# EAGLE design main_16_writer (EAGLE 7.4.0)
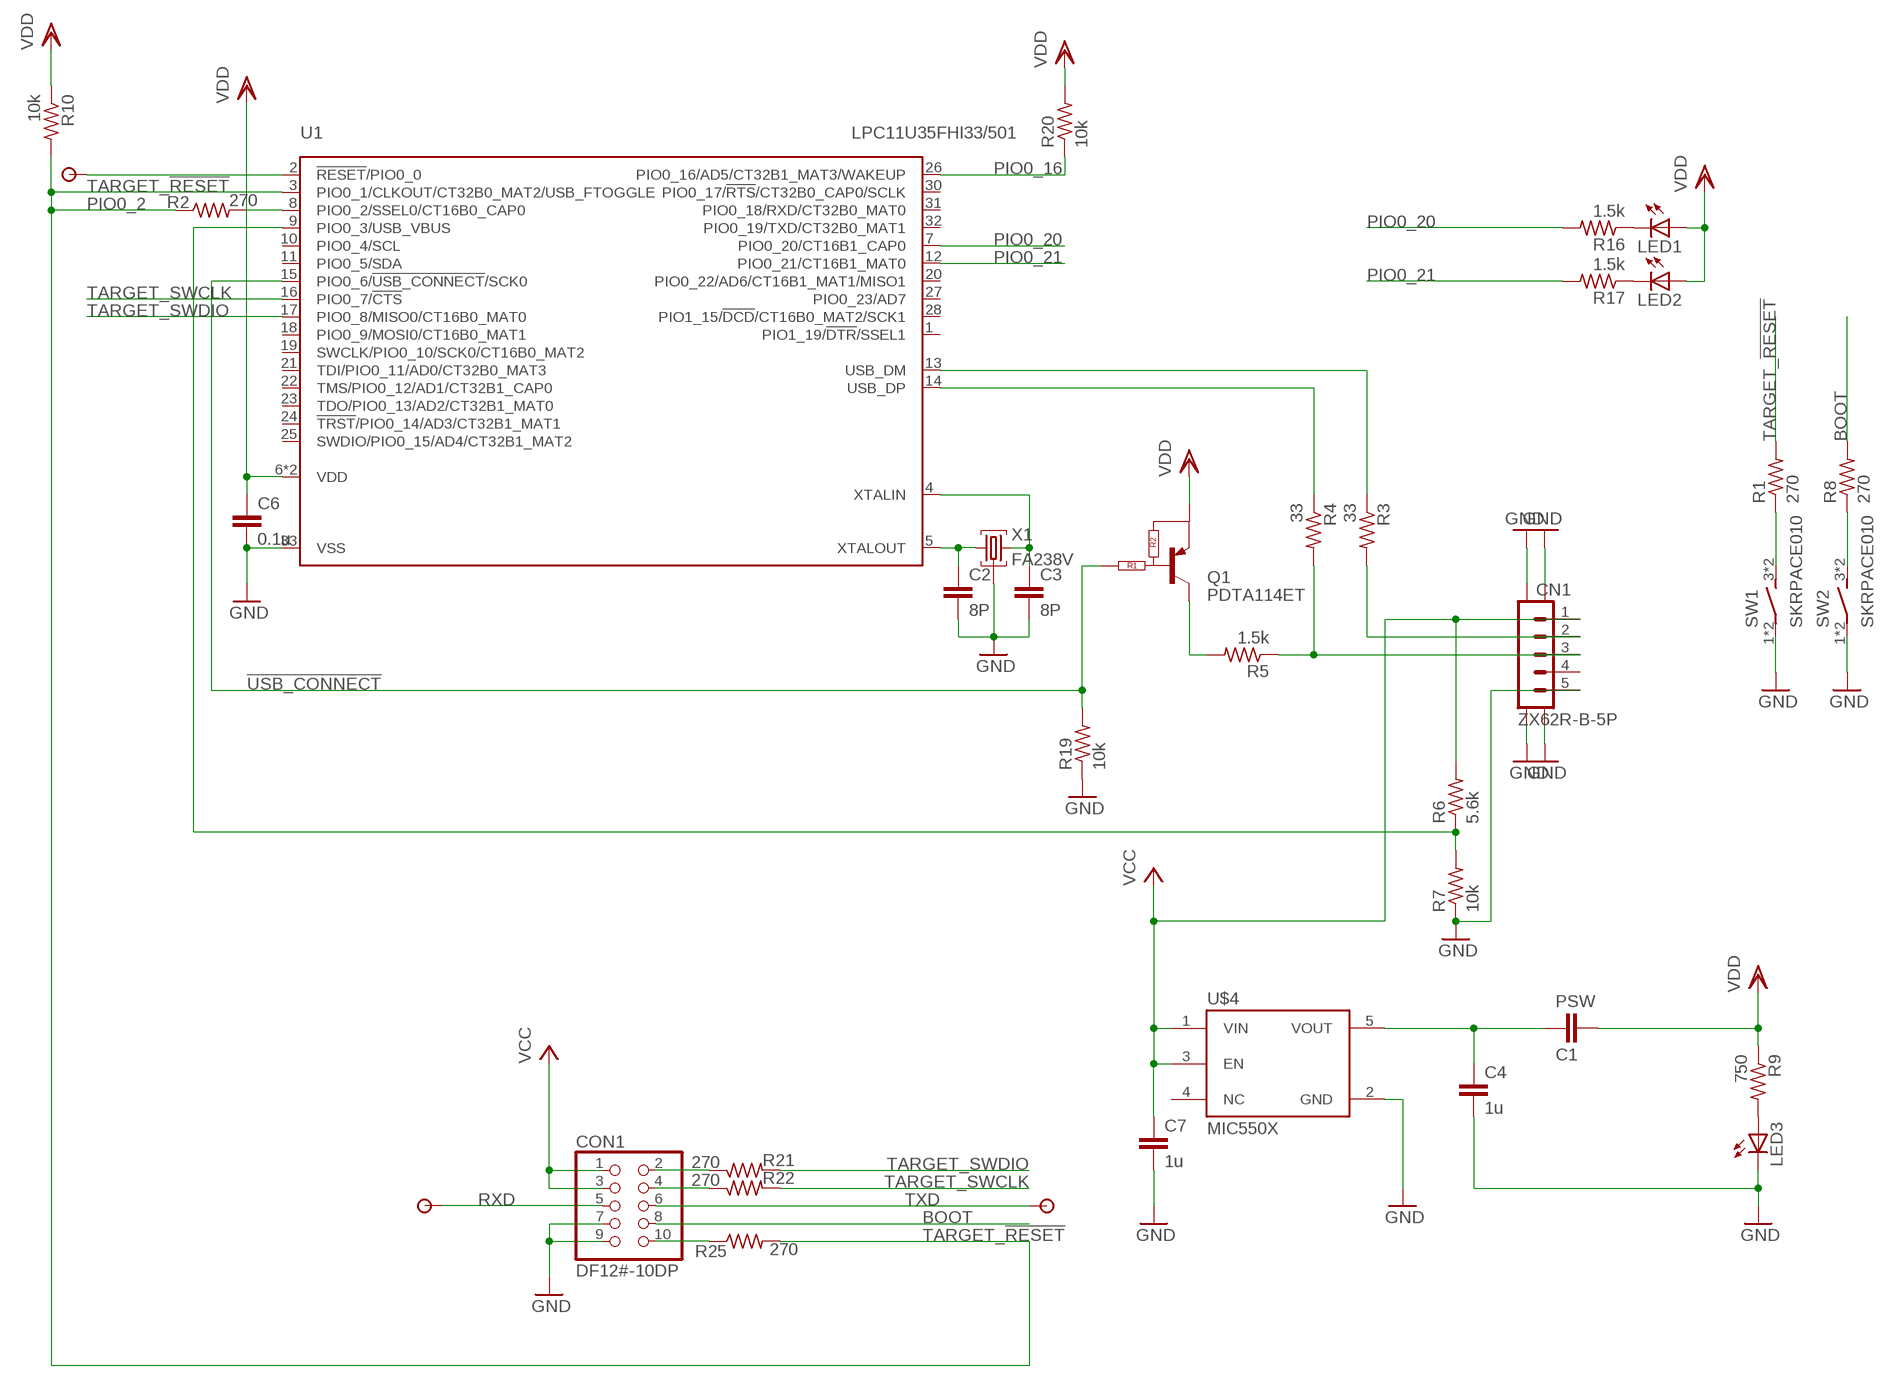
[diagram p0: schematic, sheet 1]

## Parts
C1  PSW  C-EUC3225  [C3225]
C2  8P  C-EUC0402  [C0402]
C3  8P  C-EUC0402  [C0402]
C4  1u  C-EUC0402  [C0402]
C6  0.1u  C-EUC0402  [C0402]
C7  1u  C-EUC0402  [C0402]
CN1  ZX62R-B-5P  [MICRO-B]
CON1  DF12#-10DP  [DF12D-10DP]
LED1  LEDSML0603  [SML0603]
LED2  LEDSML0603  [SML0603]
LED3  LEDSML0603  [SML0603]
Q1  PDTA114ET  [SOT23]
R1  270  R-US_R0402  [R0402]
R2  270  R-US_R0402  [R0402]
R3  33  R-US_R0402  [R0402]
R4  33  R-US_R0402  [R0402]
R5  1.5k  R-US_R0402  [R0402]
R6  5.6k  R-US_R0402  [R0402]
R7  10k  R-US_R0402  [R0402]
R8  270  R-US_R0402  [R0402]
R9  750  R-US_R0402  [R0402]
R10  10k  R-US_R0402  [R0402]
R16  1.5k  R-US_R0402  [R0402]
R17  1.5k  R-US_R0402  [R0402]
R19  10k  R-US_R0402  [R0402]
R20  10k  R-US_R0402  [R0402]
R21  270  R-US_R0402  [R0402]
R22  270  R-US_R0402  [R0402]
R25  270  R-US_R0402  [R0402]
SW1  SKRPACE010  [SKRPACE010]
SW2  SKRPACE010  [SKRPACE010]
U1  LPC11U35FHI33/501  [SOT617-3]
U$1  TESTPAD  [TESTPAD]
U$2  TESTPAD  [TESTPAD]
U$3  TESTPAD  [TESTPAD]
U$4  MIC550X  [SOT23_5PIN]
X1  FA238V  [V66RA]

## Nets
!USB_CONNECT!: Q1.1(INPUT) R19.2 U1.15(PIO0_6/!USB_CONNECT!/SCK0)
BOOT: CON1.8 R8.2
D+USB: CN1.3(3.D+) R4.2 R5.1
D-USB: CN1.2(4.ID) R3.2
GND: C2.2 C3.2 C4.2 C6.2 C7.2 CN1.5(1.VBUS) CN1.CASE@1 CN1.CASE@2 CN1.CASE@3 CN1.CASE@4 CON1.7 CON1.9 LED3.C R7.1 R19.1 SW1.1(P) SW1.2(P) SW2.1(P) SW2.2(P) U1.33(VSS) U$4.2(GND) X1.P2GND(GND) X1.P4GND(GND)
N$1: LED1.C R16.1
N$2: C2.1 U1.5(XTALOUT) X1.P1X1(X1)
N$3: C3.1 U1.4(XTALIN) X1.P3X2(X2)
N$4: C1.2 C4.1 U$4.5(VOUT)
N$5: R1.1 SW1.3(S) SW1.4(S)
N$6: Q1.3(C) R5.2
N$7: R4.1 U1.14(USB_DP)
N$8: R3.1 U1.13(USB_DM)
N$9: CON1.10 R25.1
N$10: LED2.C R17.1
N$11: R8.1 SW2.3(S) SW2.4(S)
N$12: U1.2(!RESET!/PIO0_0) U$3.P$1
N$14: CON1.2 R21.1
N$15: CON1.4 R22.1
N$20: LED3.A R9.2
PIO0_2: R2.2 U1.8(PIO0_2/SSEL0/CT16B0_CAP0)
PIO0_16: R20.1 U1.26(PIO0_16/AD5/CT32B1_MAT3/WAKEUP)
PIO0_20: R16.2 U1.7(PIO0_20/CT16B1_CAP0)
PIO0_21: R17.2 U1.12(PIO0_21/CT16B1_MAT0)
RXD: CON1.5 U$2.P$1
TARGET_!RESET!: R1.2 R2.1 R10.2 R25.2 U1.3(PIO0_1/CLKOUT/CT32B0_MAT2/USB_FTOGGLE)
TARGET_SWCLK: R22.2 U1.16(PIO0_7/!CTS!)
TARGET_SWDIO: R21.2 U1.17(PIO0_8/MISO0/CT16B0_MAT0)
TXD: CON1.6 U$1.P$1
USB_VBUS: R6.1 R7.2 U1.9(PIO0_3/USB_VBUS)
VCC: C7.1 CN1.1(5.GND) CON1.1 CON1.3 R6.2 U$4.1(VIN) U$4.3(EN)
VDD: C1.1 C6.1 LED1.A LED2.A Q1.2(E) R9.1 R10.1 R20.2 U1.6(VDD) U1.29(VDD)
Unconnected: CN1.4(2.D-) U1.1(PIO1_19/!DTR!/SSEL1) U1.10(PIO0_4/SCL) U1.11(PIO0_5/SDA) U1.18(PIO0_9/MOSI0/CT16B0_MAT1) U1.19(SWCLK/PIO0_10/SCK0/CT16B0_MAT2) U1.20(PIO0_22/AD6/CT16B1_MAT1/MISO1) U1.21(TDI/PIO0_11/AD0/CT32B0_MAT3) U1.22(TMS/PIO0_12/AD1/CT32B1_CAP0) U1.23(TDO/PIO0_13/AD2/CT32B1_MAT0) U1.24(!TRST!/PIO0_14/AD3/CT32B1_MAT1) U1.25(SWDIO/PIO0_15/AD4/CT32B1_MAT2) U1.27(PIO0_23/AD7) U1.28(PIO1_15/!DCD!/CT16B0_MAT2/SCK1) U1.30(PIO0_17/!RTS!/CT32B0_CAP0/SCLK) U1.31(PIO0_18/RXD/CT32B0_MAT0) U1.32(PIO0_19/TXD/CT32B0_MAT1) U$4.4(NC)

## Library data of the parts
C1-C4 C6 C7 = rcl:C-EU: CAPACITOR, European symbol
CN1 = con-USB:ZX62R-B-5P
CON1 = untitled:DF12#-10
LED1-LED3 = led:LED: LED OSRAM: - CHIPLED LG R971, LG N971, LY N971, LG Q971, LY Q971, LO R971, LY R971 LH N974, LH R974 LS Q976, LO Q976, LY Q976 LO Q996 - Hyper CHIPLED LW Q18S LB Q993, LB Q99A, LB R99A - SideLED LS A670, LO A670, LY A670, LG A670, LP A670 LB A673, LV A673, LT A673, LW A673 LH A674 LY A675 LS A676, LA A676, LO A676, LY A676, LW A676 LS A679, LY A679, LG A679 - Hyper Micro SIDELED® LS Y876, LA Y876, LO Y876, LY Y876 LT Y87S - SmartLED LW L88C, LW L88S LB L89C, LB L89S, LG L890 LS L89K, LO L89K, LY L89K LS L896, LA L896, LO L896, LY L896 - TOPLED LS T670, LO T670, LY T670, LG T670, LP T670 LSG T670, LSP T670, LSY T670, LOP T670, LYG T670 LG T671, LOG T671, LSG T671 LB T673, LV T673, LT T673, LW T673 LH T674 LS T676, LA T676, LO T676, LY T676, LB T676, LH T676, LSB T676, LW T676 LB T67C, LV T67C, LT T67C, LS T67K, LO T67K, LY T67K, LW E67C LS E67B, LA E67B, LO E67B, LY E67B, LB E67C, LV E67C, LT E67C LW T67C LS T679, LY T679, LG T679 LS T770, LO T770, LY T770, LG T770, LP T770 LB T773, LV T773, LT T773, LW T773 LH T774 LS E675, LA E675, LY E675, LS T675 LS T776, LA T776, LO T776, LY T776, LB T776 LHGB T686 LT T68C, LB T68C - Hyper Mini TOPLED® LB M676 - Mini TOPLED Santana® LG M470 LS M47K, LO M47K, LY M47K Source: http://www.osram.convergy.de LUXEON: - LUMILED® LXK2-PW12-R00, LXK2-PW12-S00, LXK2-PW14-U00, LXK2-PW14-V00 LXK2-PM12-R00, LXK2-PM12-S00, LXK2-PM14-U00 LXK2-PE12-Q00, LXK2-PE12-R00, LXK2-PE12-S00, LXK2-PE14-T00, LXK2-PE14-U00 LXK2-PB12-K00, LXK2-PB12-L00, LXK2-PB12-M00, LXK2-PB14-N00, LXK2-PB14-P00, LXK2-PB14-Q00 LXK2-PR12-L00, LXK2-PR12-M00, LXK2-PR14-Q00, LXK2-PR14-R00 LXK2-PD12-Q00, LXK2-PD12-R00, LXK2-PD12-S00 LXK2-PH12-R00, LXK2-PH12-S00 LXK2-PL12-P00, LXK2-PL12-Q00, LXK2-PL12-R00 Source: www.luxeon.com KINGBRIGHT: KA-3528ASYC Source: www.kingbright.com
Q1 = nxp_60_1_1:PDTA114: PNP Resistor-Equipped Transistor (RET) family in small Surface-Mounted Device (SMD) plastic packages. AAL Eindhoven MK
R1-R10 R16 R17 R19-R22 R25 = rcl:R-US_: RESISTOR, American symbol
SW1 SW2 = untitled:SKRPACE010
U1 = nxp_60_1_1:LPC11U35FHI33: 32-bit ARM Cortex-M0 microcontroller; up to 128 kB flash; up to 12 kB SRAM and 4 kB EEPROM; USB device; USART The LPC11U3x are a ARM Cortex-M0 based, low-cost 32-bit MCU family, designed for 8/16-bit microcontroller applications, offering performance, low power, simple instruction set and memory addressing together with reduced code size compared to existing 8/16-bit architectures. The LPC11U3x operate at CPU frequencies of up to 50 MHz. Equipped with a highly flexible and configurable Full Speed USB 2.0 device controller, the LPC11U3x brings unparalleled design flexibility and seamless integration to today’s demanding connectivity solutions. The peripheral complement of the LPC11U3x includes up to 128 kB of flash memory, up to 12 kB of SRAM data memory and 4 kB EEPROM, one Fast-mode Plus I 2 C-bus interface, one RS-485/EIA-485 USART with support for synchronous mode and smart card interface, two SSP interfaces, four general purpose counter/timers, a 10-bit ADC, and up to 54 general purpose I/O pins. AAL Eindhoven MK; FLASH: 64kB; GPIO: 26; SRAM: 12kB
U$1-U$3 = untitled:TESTPAD
U$4 = untitled:MIC550X
X1 = 201508-noshiro:FA238V: EPSON TOYOCOM CRYSTAL V66RA package FA238V

## Board
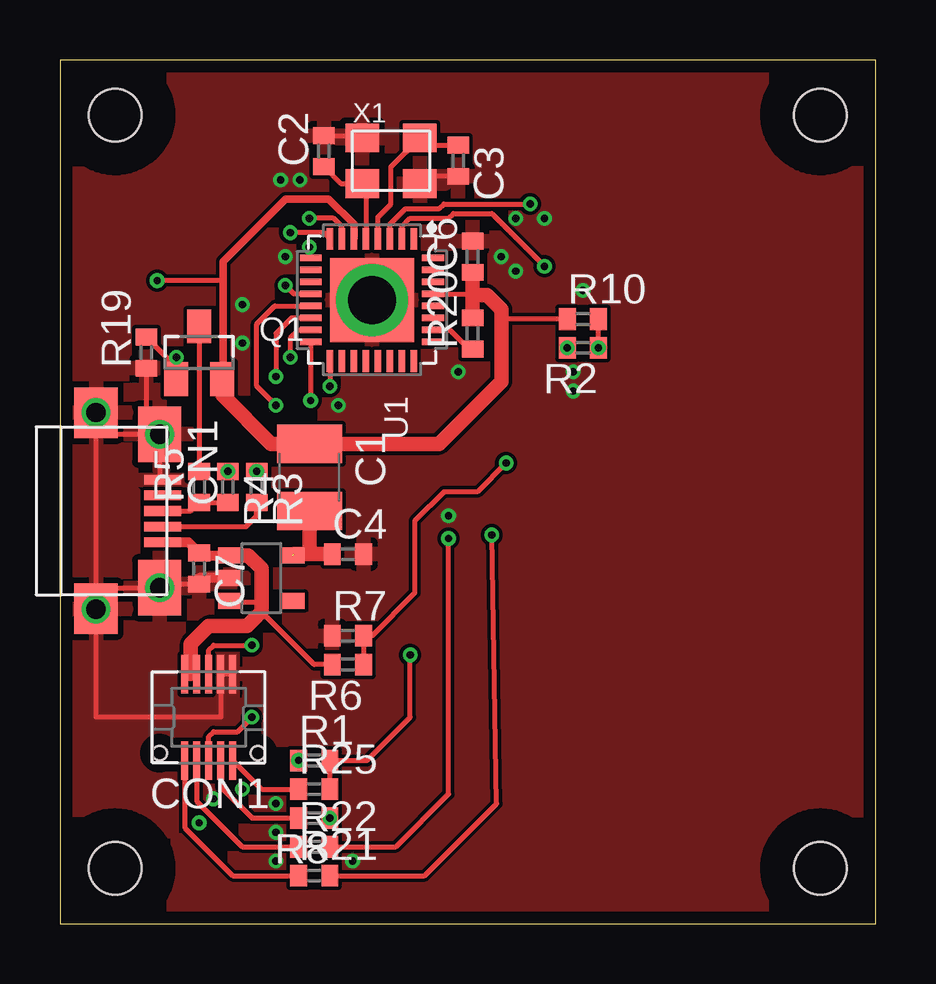
[diagram p1: board, top side]
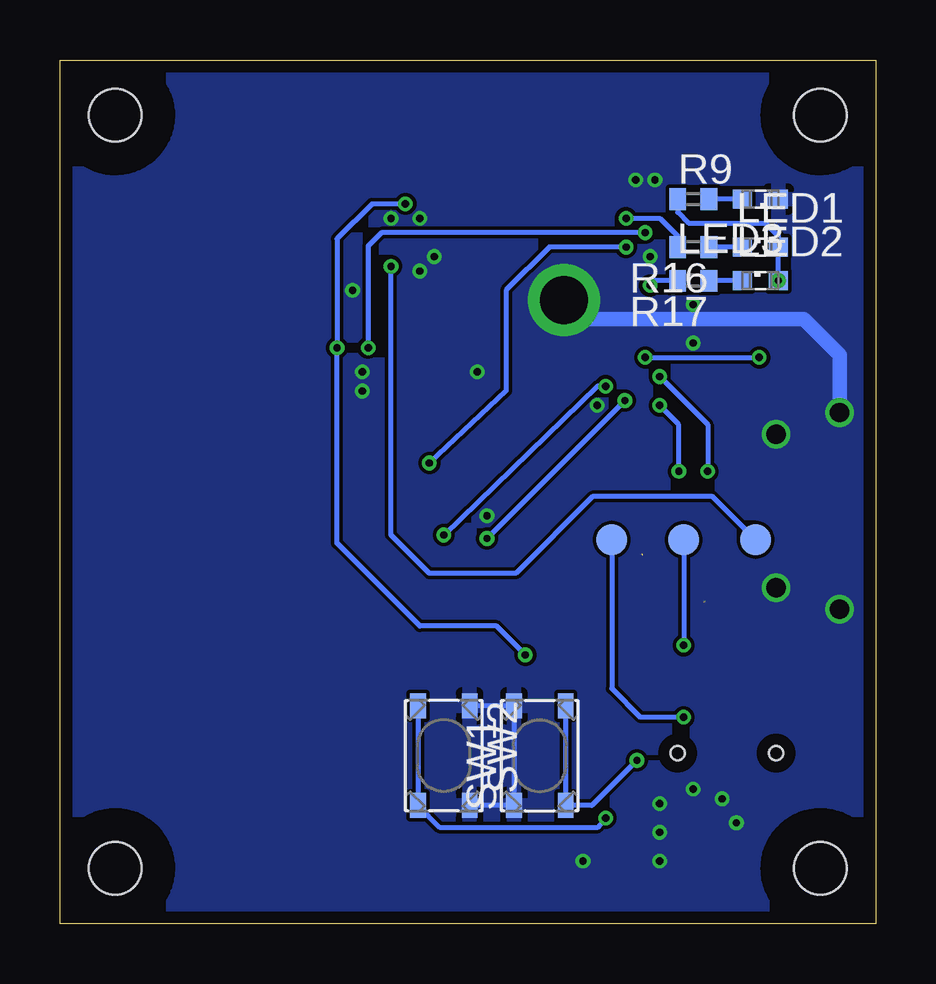
[diagram p2: board, bottom side, seen from below]

Size 34 x 36 mm. Coordinates in mm from the lower left corner, seen from the top.
Outline: 0,0 34,0 34,36 0,36 0,0
Copper layers (1*16): Top 0.035mm / dielectric 1.6mm / Bottom 0.035mm
Design rules "Elecrow_2-layer_PCB_eagle_rule": minimum track width 6mil, minimum drill 12mil, track to track 6mil, track to pad 6mil, pad to pad 6mil, via to via 8mil, smd to smd 0mil, copper to edge 20mil, drill to drill 10mil, minimum pad ring 6mil, minimum via ring 6mil, stop-mask expansion 0mil, vias tented up to drill 100mil, thermal gap 10mil
Holes 2.2 mm at 2.3,2.3 31.7,2.3 31.7,33.7 2.3,33.7
tRestrict: area 0,0 to 4.6,4.6; area 29.4,0 to 34,4.6; area 29.4,31.4 to 34,36; area 0,31.4 to 4.6,36
bRestrict: area 0,0 to 4.6,4.6; area 29.4,0 to 34,4.6; area 29.4,31.4 to 34,36; area 0,31.4 to 4.6,36

### Footprints (pad centres in the part's own frame; a part is rotated, then mirrored left to right if it is on the bottom)
C3225 = smd 1.6 x 2.7: 1 -1.4,0; 2 1.4,0
C0402 = smd 0.7 x 0.9: 1 -0.65,0; 2 0.65,0
MICRO-B = smd 0.4 x 1.55: 1 1.3,2.775; 2 0.65,2.775; 3 0,2.775; 4 -0.65,2.775; 5 -1.3,2.775 | smd 2.3 x 1.8: CASE@1 -3.2,2.65; CASE@2 3.2,2.65 | smd 2.1 x 1.8: CASE@3 -4.1,0; CASE@4 4.075,0
DF12D-10DP = smd 0.3 x 1.6 bottom: 1 -1,-1.8; 2 -1,1.8; 3 -0.5,-1.8; 4 -0.5,1.8; 5 0,-1.8; 6 0,1.8; 7 0.5,-1.8; 8 0.5,1.8; 9 1,-1.8; 10 1,1.8 | hole 0.6: 2.05,1.5; -2.05,1.5
SML0603 = smd 0.8 x 0.8: A 0.75,0; C -0.75,0
SOT23 = smd 1 x 1.4: 1 -0.95,-1.1; 2 0.95,-1.1; 3 0,1.1
R0402 = smd 0.7 x 0.9: 1 -0.65,0; 2 0.65,0
SKRPACE010 = smd 1.05 x 0.65: 1 -2.075,1.075; 2 2.075,1.075; 3 -2.075,-1.075; 4 2.075,-1.075
SOT617-3 = smd 0.9 x 0.29: 1 -2.55,1.75; 2 -2.55,1.25; 3 -2.55,0.75; 4 -2.55,0.25; 5 -2.55,-0.25; 6 -2.55,-0.75; 7 -2.55,-1.25; 8 -2.55,-1.75; 17 2.55,-1.75; 18 2.55,-1.25; 19 2.55,-0.75; 20 2.55,-0.25; 21 2.55,0.25; 22 2.55,0.75; 23 2.55,1.25; 24 2.55,1.75 | smd 0.29 x 0.9: 9 -1.75,-2.55; 10 -1.25,-2.55; 11 -0.75,-2.55; 12 -0.25,-2.55; 13 0.25,-2.55; 14 0.75,-2.55; 15 1.25,-2.55; 16 1.75,-2.55; 25 1.75,2.55; 26 1.25,2.55; 27 0.75,2.55; 28 0.25,2.55; 29 -0.25,2.55; 30 -0.75,2.55; 31 -1.25,2.55; 32 -1.75,2.55 | smd 3.5 x 3.5: 33 0,0
TESTPAD = smd 1.27 x 1.27: P$1 0,0
SOT23_5PIN = smd 0.66 x 1: 1 0.95,1.3; 2 0,1.3; 3 -0.95,1.3; 4 -0.95,-1.3; 5 0.95,-1.3
V66RA = smd 1.4 x 1.2: P1X1 -1.2,-0.95; P2GND 1.2,-0.95; P3X2 1.2,0.95; P4GND -1.2,0.95

### Placement (x,y rotation side)
C1  10.4,18.6 270 top
C2  11,32.2 90 top
C3  16.6,31.8 270 top
C4  12,15.4 0 top
C6  17.2,27.8 90 top
C7  5.8,14.8 270 top
CN1  1.5,17.2 270 top
CON1  6.2,8.6 180 bottom
LED1  4.8,28.2 0 bottom
LED2  4.8,26.8 0 bottom
LED3  4.8,30.2 180 bottom
Q1  5.8,23.8 0 top
R1  10.6,6.8 0 top
R2  21.8,24 180 top
R3  8.2,18.2 270 top
R4  7,18.2 270 top
R5  5.8,18.2 90 top
R6  12,10.8 180 top
R7  12,12 0 top
R8  10.6,4.4 180 top
R9  7.6,30.2 0 bottom
R10  21.8,25.2 0 top
R16  7.6,28.2 180 bottom
R17  7.6,26.8 180 bottom
R19  3.6,23.8 90 top
R20  17.2,24.6 90 top
R21  10.6,2 0 top
R22  10.6,3.2 0 top
R25  10.6,5.6 0 top
SW1  14,7 90 bottom
SW2  18,7 270 bottom
U1  13,26 270 top
U$1  11,16 0 bottom
U$2  8,16 0 bottom
U$3  5,16 0 bottom
U$4  8.4,14.4 90 top
X1  13.8,31.8 0 top

### Tracks (layer width: path | path; a pad name or v marks a point on that pad's centre or on a via)
!USB_CONNECT!  (via drill 0.3)
  Top 0.203: R19.2 4.85,23.2 | 4.85,23.2 Q1.1 | U1.15 9.95,24.75 9.6,24.4 v9.6,23.6 | 4.85,23.2 v4.85,23.6
  Bottom 0.203: v9.6,23.6 v4.85,23.6
BOOT
  Top 0.203: CON1.8 6.7,5.7 8,4.4 R8.2
D+USB
  Top 0.203: CN1.3 5.45,17.2 R5.1 R4.2
D-USB
  Top 0.203: CN1.2 7.75,16.55 8.2,17 R3.2
GND  (via drill 0.3, 0.8, 2)
  Top 0.203: C7.2 4.15,14.15 CN1.CASE@2 1.5,14 CN1.CASE@4 | 3.6,20.4 1.5,20.4 CN1.CASE@3 CN1.CASE@4 | CN1.5 4.15,18.5 CN1.CASE@1 3.6,20.4 | CON1.9 CON1.7 6.7,8.6 1.5,8.6 CN1.CASE@4 | R19.1 3.6,20.4 | C2.2 12.5,32.85 X1.P4GND | C3.2 15.3,31.15 X1.P2GND
  Top 0.406: U$4.2 5.8,14.4 C7.2
  Bottom 0.203: SW2.1 SW1.2 SW1.1 SW2.2
  Bottom 0.61: U1.33 12.2,25.2 3,25.2 1.5,23.7 CN1.CASE@3
  other vias: 13,26 1.5,21.3 9,2.6 9,3.8 9,5 7.6,5.6 6.4,5.2 5.8,4.2 12.2,2.6 11.6,21.6 16.6,23 7.6,24.2 9.4,27.8 1.5,13.1 4.15,14 4.15,20.4 19,29.4 20.2,29.4 21.8,26.4 7.6,25.8 21.4,23 21.4,22.2 18.4,27.8 19,27.2 10,31 9.2,31 16.2,17
  pour Bottom: 0,36 34,36 34,0 0,0
  pour Top: 0,36 34,36 34,0 0,0
N$1
  Bottom 0.203: LED1.C R16.1
N$2
  Top 0.203: C2.1 11.7,30.85 X1.P1X1 12.75,30.7 U1.5
N$3
  Top 0.203: C3.1 15.3,32.45 X1.P3X2 13.8,31.55 13.8,30 13.25,29.45 U1.4
N$4  (1 unrouted)
  Top 0.203: 10.4,15.4 C4.1
  Top 0.61: 9.75,15.4 C4.1 | C1.2 10.4,15.4
N$5  (via drill 0.3)
  Bottom 0.203: R1.1 11.82,4.92 SW1.3 SW1.4
  other vias: 9.95,6.8
N$6
  Top 0.203: Q1.3 R5.2
N$7  (via drill 0.3)
  Top 0.203: U1.14 9.65,25.25 9,24.6 v9,22.8
  Bottom 0.203: v9,22.8 7,20.8 R4.1
  other vias: 7,18.85
N$8  (via drill 0.3)
  Top 0.203: U1.13 8.95,25.75 8.2,25 8.2,22.4 v9,21.6
  Bottom 0.203: R3.1 8.2,20.8 v9,21.6
  other vias: 8.2,18.85
N$9
  Top 0.203: CON1.10 8.4,5.6 R25.1
N$10
  Bottom 0.203: LED2.C R17.1
N$11  (via drill 0.3)
  Bottom 0.203: SW2.3 SW2.4 18.15,4 11.6,4 R8.1
  other vias: 11.25,4.4
N$12  (via drill 0.3)
  Top 0.203: U1.2 14.25,29.05 14.6,29.4 16.2,29.4 16.4,29.6 18,29.6 v20.2,27.4
  Bottom 0.203: U$3.P$1 6.8,17.8 11.8,17.8 15,14.6 18.6,14.6 20.2,16.2 v20.2,27.4
N$14
  Top 0.203: CON1.2 5.2,4 7.2,2 R21.1
N$15
  Top 0.203: CON1.4 5.7,5.1 7.6,3.2 R22.1
N$20
  Bottom 0.203: LED3.A R9.2
PIO0_2  (via drill 0.3)
  Top 0.203: U1.8 11,28.8 v9.6,28.8
  Bottom 0.203: v9.6,28.8 20.6,28.8 21.15,28.25 R2.2
  other vias: 21.15,24
PIO0_16
  Top 0.203: U1.26 16.25,24.75 17.05,23.95 R20.1
PIO0_20  (via drill 0.3)
  Top 0.203: U1.7 11.75,29.05 11.4,29.4 v10.4,29.4
  Bottom 0.203: v10.4,29.4 9,29.4 8.25,28.65 R16.2
PIO0_21  (via drill 0.3)
  Top 0.203: U1.12 9.75,26.25 v9.4,26.6
  Bottom 0.203: v9.4,26.6 9.2,26.8 R17.2
RXD  (via drill 0.3)
  Top 0.203: CON1.5 6.2,11.4 6.4,11.6 v8,11.6
  Bottom 0.203: U$2.P$1 v8,11.6
TARGET_!RESET!  (via drill 0.3)
  Top 0.203: U1.3 13.75,29.15 14.4,29.8 15.8,29.8 16,30 v19.6,30 | R25.2 R1.2 12.8,6.8 14.6,8.6 v14.6,11.2 | R2.1 R10.2
  Bottom 0.203: v14.6,11.2 15.8,12.4 19,12.4 22.45,15.86 R2.1 22.45,28.55 21,30 v19.6,30
  other vias: 22.45,24
TARGET_SWCLK  (via drill 0.3)
  Top 0.203: U1.16 v10.45,21.8 | R22.2 14,3.2 16.2,5.4 v16.2,16.05
  Bottom 0.203: v16.2,16.05 v10.45,21.8
TARGET_SWDIO  (via drill 0.3)
  Top 0.203: U1.17 v11.25,22.4 | R21.2 15.2,2 18.2,5 v18,16.2
  Bottom 0.203: v11.25,22.4 11.6,22.4 v18,16.2
TXD  (via drill 0.3)
  Top 0.203: CON1.6 6.2,7.8 6.4,8 7.4,8 v8,8.6
  Bottom 0.203: v8,8.6 9.8,8.6 11,9.8 U$1.P$1
USB_VBUS  (via drill 0.3)
  Top 0.203: v18.6,19.2 17.4,18 16,18 14.8,16.8 14.8,13.8 13,12 R7.2 R6.1 | U1.9 10.4,27.75 v10.4,28.2 10.4,27.8 U1.9
  Bottom 0.203: 10.4,28 v10.4,28.2 13.6,28.2 15.4,26.4 15.4,22.2 v18.6,19.2
VCC  (1 unrouted)
  Top 0.203: 7.15,13.4 8.4,13.4 | CON1.1 5.45,10.4 CON1.3 | R6.2 10.6,10.8 8.6,12.8 8.2,12.8
  Top 0.406: CN1.1 5.35,15.9 C7.1 5.8,15.35 U$4.1
  Top 0.61: 5.45,10.4 5.45,11.65 6.2,12.4 7.8,12.4 8.2,12.8 8.4,13 8.4,13.4 8.4,14.8 7.85,15.35 U$4.1
VDD  (via drill 0.3)
  Top 0.203: U1.29 17.2,26.25 | C6.1 17.2,26.25 | 17.2,26.25 17.2,26.2 | 17.2,25.4 R20.2 | 6.8,26.8 LED2.A | R10.1 18.4,25.2
  Top 0.305: U1.6 12.25,29.15 11.2,30.2 9.4,30.2 6.8,27.6 6.8,26.8 6.8,22.75
  Top 0.61: 6.8,22.75 Q1.2 6.75,22.05 8.8,20 C1.1 15.8,20 18.4,22.6 18.4,25.2 18.4,25.6 17.8,26.2 17.2,26.2 | C6.1 17.2,26.2 | 17.2,25.4 17.2,26.2
  Bottom 0.203: LED2.A LED1.A 4.05,28.65 4.6,29.2 7.8,29.2 8.25,29.65 R9.1
  other vias: 4.05,26.8